# Altium schematic sheet Mic_top.SchDoc
size A4; SheetNumber: 2; SheetTotal: 3
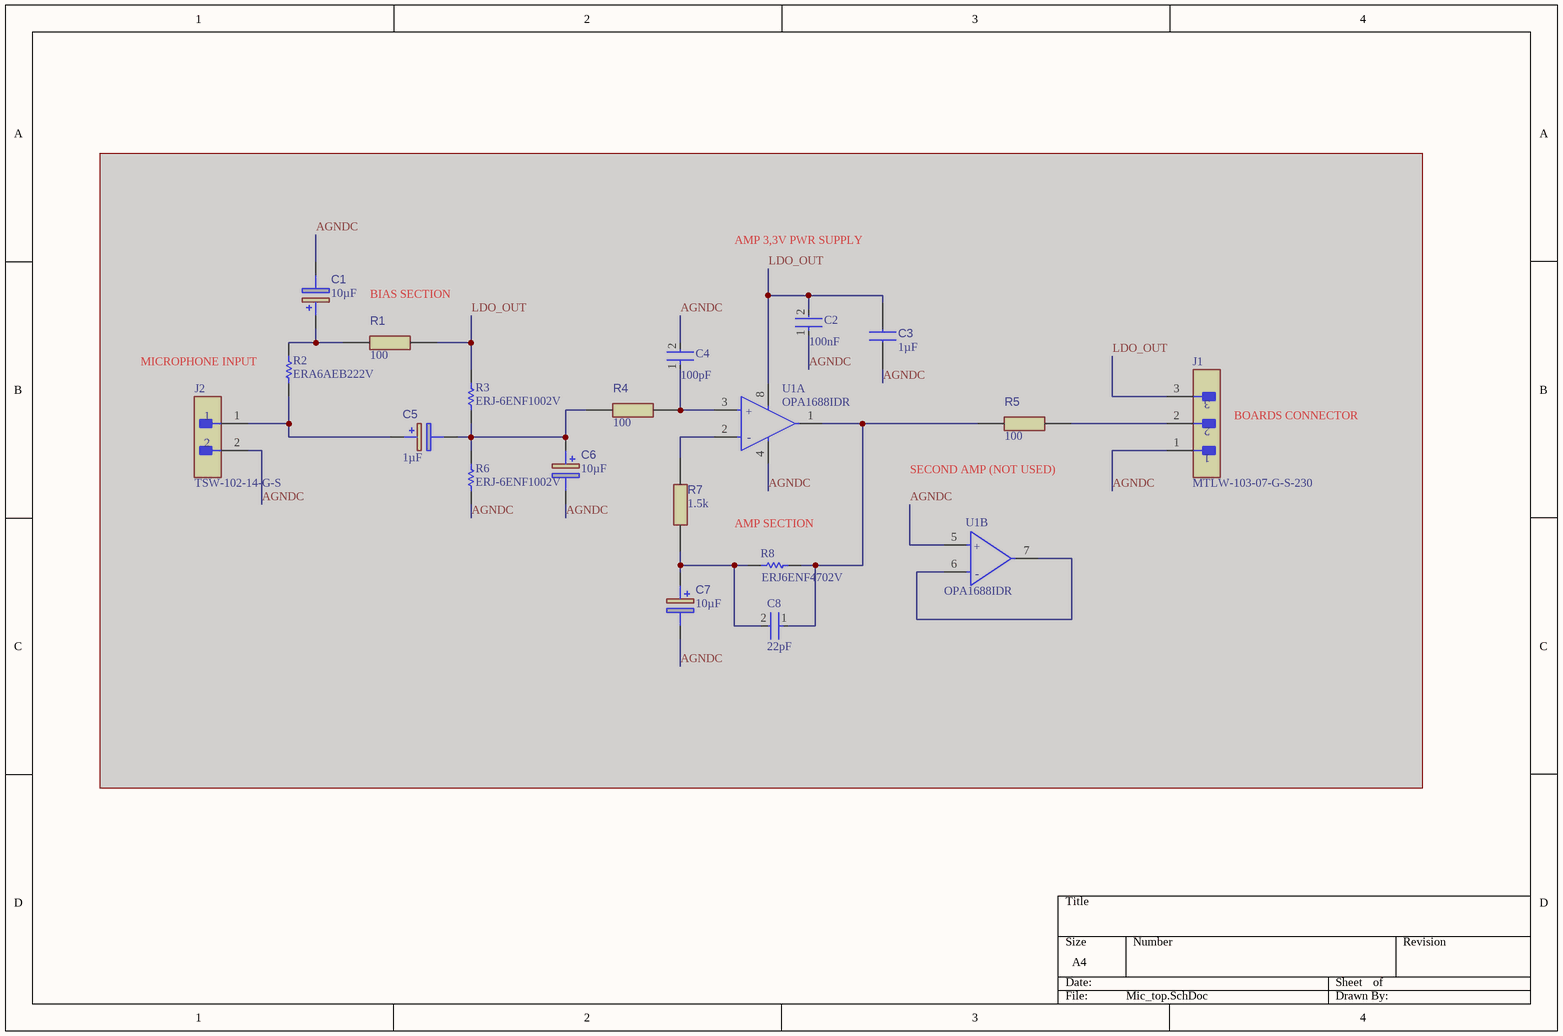
[diagram p0: Mic_top.SchDoc]

## Parts
C1  value 10µF  [593D106X9016B2TE3-Footprint-1]  (hidden comment: 593D106X9016B2TE3)  (masked out: inside a compile mask, not in the netlist)
C2  Capacitance: 100nF  [FP-0805B-IPC_C]  (hidden comment: 0805B104K500CT)  (masked out: inside a compile mask, not in the netlist)
C3  value 1µF  [08055C105KAT2A-Footprint-1]  (hidden comment: 08055C105KAT2A)  (masked out: inside a compile mask, not in the netlist)
C4  Capacitance: 100pF  [FP-0805B-IPC_C]  (hidden comment: 0805B104K500CT)  (masked out: inside a compile mask, not in the netlist)
C5  value 1µF  [293D105X9016A2TE3-Footprint-1]  (hidden comment: 293D105X9016A2TE3)  (masked out: inside a compile mask, not in the netlist)
C6  value 10µF  [593D106X9016B2TE3-Footprint-1]  (hidden comment: 593D106X9016B2TE3)  (masked out: inside a compile mask, not in the netlist)
C7  value 10µF  [593D106X9016B2TE3-Footprint-1]  (hidden comment: 593D106X9016B2TE3)  (masked out: inside a compile mask, not in the netlist)
C8  Capacitance: 22pF  [FP-0805B-IPC_C]  (hidden comment: 0805B104K500CT)  (masked out: inside a compile mask, not in the netlist)
J1  MTLW-103-07-G-S-230  [FP-MTLW-103-07-G-S-230-MFG]  (masked out: inside a compile mask, not in the netlist)
J2  TSW-102-14-G-S  [FP-TSW-102-14-G-S-MFG]  (masked out: inside a compile mask, not in the netlist)
R1  value 100  [AR05BTCW1501-Footprint-1]  (hidden comment: AR05BTCW1501)  (masked out: inside a compile mask, not in the netlist)
R2  ERA6AEB222V  [RESC2013X60X40LL20T25]  (masked out: inside a compile mask, not in the netlist)
R3  ERJ-6ENF1002V  [RESC2013X70X40ML20T20]  (masked out: inside a compile mask, not in the netlist)
R4  value 100  [AR05BTCW1501-Footprint-1]  (hidden comment: AR05BTCW1501)  (masked out: inside a compile mask, not in the netlist)
R5  value 100  [AR05BTCW1501-Footprint-1]  (hidden comment: AR05BTCW1501)  (masked out: inside a compile mask, not in the netlist)
R6  ERJ-6ENF1002V  [RESC2013X70X40ML20T20]  (masked out: inside a compile mask, not in the netlist)
R7  value 1.5k  [AR05BTCW1501-Footprint-1]  (hidden comment: AR05BTCW1501)  (masked out: inside a compile mask, not in the netlist)
R8  ERJ6ENF4702V  [RESC2013X70X40ML20T20]  (masked out: inside a compile mask, not in the netlist)
U1  OPA1688IDR  [FP-D0008A-MFG]  (parts A,B of 2)  (masked out: inside a compile mask, not in the netlist)

## Notes on the sheet
- AMP 3,3V PWR SUPPLY
- BIAS SECTION
- MICROPHONE INPUT
- (near J1) BOARDS CONNECTOR
- (near R5) SECOND AMP (NOT USED)
- AMP SECTION
- (in symbol CMP-04894-000046-1, part A) +; -
- (in symbol CMP-04894-000046-1, part B) +; -

## Library data of the parts
C1 C6 C7 = CMP-001-00089-1: Cap Tant Solid 10uF 16V B CASE 10% (3.5 X 2.8 X 1.9mm) Inward L SMD 3528-21 0.8 Ohm 125C T/R; Ripple Current: 132mA; Pins: 2; Case/Package: 1411; Voltage Rating: 16V; Min Operating Temperature: -55°C; Max Operating Temperature: 125°C; Tolerance: 10%; Mounting Technology: Surface Mount
C2 C4 C8 = CMP-45632-000003-1: CAP CER 0.1UF 50V X7R 0805; Tolerance: 10%; RoHS Compliant: Yes; Packaging: Tape and Reel; Voltage Rating (DC): 50V; Voltage Rating: 50V; Length: 2mm; Lead Free: Lead Free; Voltage: 50V; Case/Package: 0805; Case Code (Metric): 2012; Depth: 1.25mm; Min Operating Temperature: -55°C; Case Code (Imperial): 0805; Max Operating Temperature: 125°C; Radiation Hardening: No; Dielectric: X7R
C3 = CMP-001-00087-1: 0805 Standard 1UF Ceramic Multilayer Capacitor, 50V, +125C, X7R Dielectric, +/-10%; Tolerance: 10%; Mounting Technology: Surface Mount; Min Operating Temperature: -55°C; Case/Package: 0805; Max Operating Temperature: 125°C; Voltage Rating: 50V
C5 = CMP-001-00090-1: Cap Tant Solid 1uF 16V A CASE 10% (3.2 X 1.6 X 1.6mm) SMD 3216-18 9.3 Ohm 125 C T/R; Ripple Current: 36mA; Min Operating Temperature: -55°C; Pins: 2; Case/Package: 1206; Tolerance: 10%; Mounting Technology: Surface Mount; Max Operating Temperature: 125°C; Voltage Rating: 16V
J1 = CMP-02766-001679-1: CONN HEADER VERT 3POS 2.54MM; Max Current Rating: 3A; Number of Contacts: 3; Gender: Male; Contact Material: Bronze; Pitch: 2.54mm; Housing Material: Polymer; Contact Plating: Gold; Radiation Hardening: No; Depth: 2.48mm; Packaging: Bulk; Number of Rows: 1; Max Operating Temperature: 125°C; Housing Color: Black; Termination: Solder; Min Operating Temperature: -55°C; Length: 7.62mm; RoHS Compliant: Yes; Orientation: Straight
J2 = CMP-02766-001740-1: CONN HEADER VERT 2POS 2.54MM; Number of Positions: 2; Max Current Rating: 7.6A; Gender: Male; Max Voltage Rating (AC): 550V; Contact Mating Length: 0.32inch; REACH SVHC: No SVHC; Width: 2.54mm; Insulation Material: PBT; Contact Shape: Square; Contact Plating: Gold; Min Operating Temperature: -55°C; Contact Material: Bronze; Color: Black; Number of Contacts: 2; Housing Material: Polyester; Orientation: Straight; Flammability Rating: UL94 V-0; Max Operating Temperature: 125°C; Contact Type: Male Pin; Radiation Hardening: No; Termination: Solder; RoHS Compliant: Yes; Lead Free: Lead Free; Fastening Type: Pull; Pitch: 2.54mm; Number of Rows: 1; Series: TSW; Insulation Color: Black; Package Quantity: 1; Connector Type: Header; Length: 5.08mm; Contact Finish - Mating: GOLD; Mount: Through Hole; Housing Color: Black; Depth: 2.54mm; Packaging: Bulk
R1 R4 R5 R7 = CMP-009-00182-1: 125mW Thin Film Resistor 100V ±25ppm/℃ ±0.1% 1.5kΩ 0805 Chip Resistor - Surface Mount ROHS; Mounting Technology: Surface Mount; Min Operating Temperature: -55°C; Tolerance: 0.1%; Max Operating Temperature: 155°C; Case/Package: 0805
R2 = CMP-2001-00613-1: Manufacturer: Panasonic; Part Number: ERA6AEB222V
R3 R6 = CMP-2001-04376-1: Manufacturer: Panasonic; Part Number: ERJ-6ENF1002V
R8 = CMP-2001-00551-1: Manufacturer: Panasonic; Part Number: ERJ6ENF4702V
U1 = CMP-04894-000046-1: IC OPAMP GP 2 CIRCUIT 8SOIC; Input Bias Current: 10pA; Gain Bandwidth Product: 10MHz; Min Supply Voltage: 4.5V; Common Mode Rejection Ratio: 90dB; Number of Channels: 2; Input Offset Voltage (Vos): 250uV; Min Dual Supply Voltage: 2.25V; Max Dual Supply Voltage: 18V; Max Supply Voltage: 36V; Voltage Gain: 130dB; Output Current per Channel: 75mA; Slew Rate: 8V/µs; Operating Supply Current: 1.6mA; Mount: Surface Mount; Lead Free: Lead Free; Min Operating Temperature: -40°C; Number of Pins: 8; Number of Circuits: 2; RoHS Compliant: Yes; Case/Package: SOIC; Packaging: Tape and Reel; Max Operating Temperature: 85°C